# EAGLE schematic debugBoard (EAGLE 8.3.2)
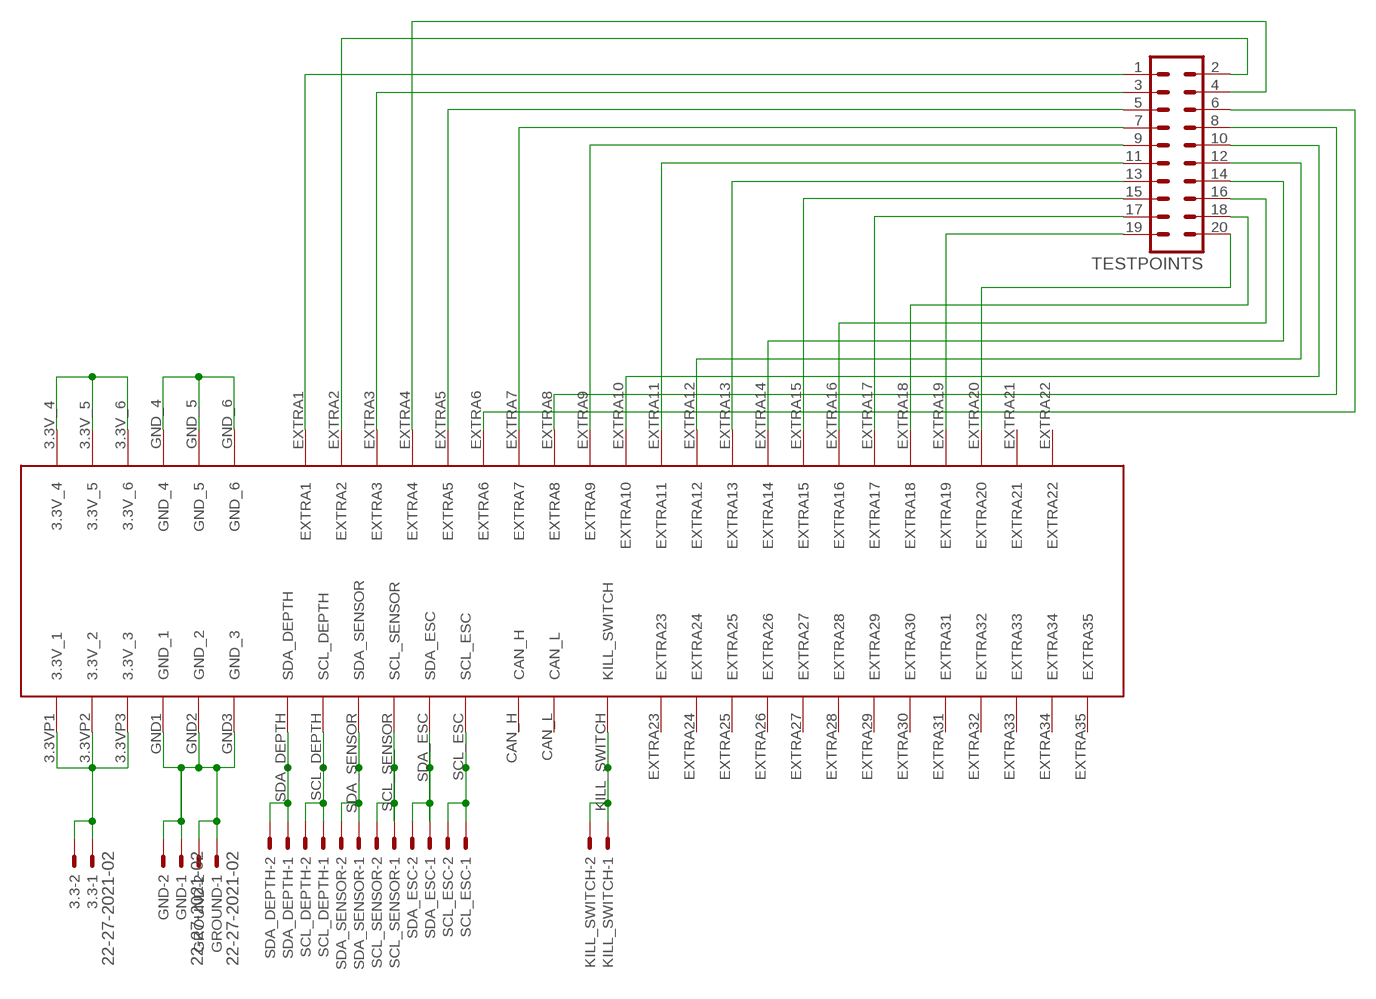
[diagram p0: schematic, sheet 1]

## Parts
3.3  22-27-2021-02  [6410-02]
GND  22-27-2021-02  [6410-02]
GROUND  22-27-2021-02  [6410-02]
KILL_SWITCH  22-27-2021-02  [6410-02]
SCL_DEPTH  22-27-2021-02  [6410-02]
SCL_ESC  22-27-2021-02  [6410-02]
SCL_SENSOR  22-27-2021-02  [6410-02]
SDA_DEPTH  22-27-2021-02  [6410-02]
SDA_ESC  22-27-2021-02  [6410-02]
SDA_SENSOR  22-27-2021-02  [6410-02]
TESTPOINTS  MA10-2  [MA10-2]
U$1  5530843  [5530843-6-BOARDFINGERS]

## Nets
3.3V: 3.3.1 3.3.2 U$1.3.3V_4 U$1.3.3V_5 U$1.3.3V_6 U$1.3.3VP1(3.3V_1) U$1.3.3VP2(3.3V_2) U$1.3.3VP3(3.3V_3)
EXTRA1: TESTPOINTS.1 U$1.EXTRA1
EXTRA2: TESTPOINTS.2 U$1.EXTRA2
EXTRA3: TESTPOINTS.3 U$1.EXTRA3
EXTRA4: TESTPOINTS.4 U$1.EXTRA4
EXTRA5: TESTPOINTS.5 U$1.EXTRA5
EXTRA6: TESTPOINTS.6 U$1.EXTRA6
EXTRA7: TESTPOINTS.7 U$1.EXTRA7
EXTRA8: TESTPOINTS.8 U$1.EXTRA8
EXTRA9: TESTPOINTS.9 U$1.EXTRA9
EXTRA10: TESTPOINTS.10 U$1.EXTRA10
EXTRA11: TESTPOINTS.11 U$1.EXTRA11
EXTRA12: TESTPOINTS.12 U$1.EXTRA12
EXTRA13: TESTPOINTS.13 U$1.EXTRA13
EXTRA14: TESTPOINTS.14 U$1.EXTRA14
EXTRA15: TESTPOINTS.15 U$1.EXTRA15
EXTRA16: TESTPOINTS.16 U$1.EXTRA16
EXTRA17: TESTPOINTS.17 U$1.EXTRA17
EXTRA18: TESTPOINTS.18 U$1.EXTRA18
EXTRA19: TESTPOINTS.19 U$1.EXTRA19
EXTRA20: TESTPOINTS.20 U$1.EXTRA20
GND: GND.1 GND.2 GROUND.1 GROUND.2 U$1.GND1(GND_1) U$1.GND2(GND_2) U$1.GND3(GND_3) U$1.GND_4 U$1.GND_5 U$1.GND_6
KILL_SWITCH: KILL_SWITCH.1 KILL_SWITCH.2 U$1.KILL_SWITCH
SCL_DEPTH: SCL_DEPTH.1 SCL_DEPTH.2 U$1.SCL_DEPTH
SCL_ESC: SCL_ESC.1 SCL_ESC.2 U$1.SCL_ESC
SCL_SENSOR: SCL_SENSOR.1 SCL_SENSOR.2 U$1.SCL_SENSOR
SDA_DEPTH: SDA_DEPTH.1 SDA_DEPTH.2 U$1.SDA_DEPTH
SDA_ESC: SDA_ESC.1 SDA_ESC.2 U$1.SDA_ESC
SDA_SENSOR: SDA_SENSOR.1 SDA_SENSOR.2 U$1.SDA_SENSOR
Unconnected: U$1.CAN_H U$1.CAN_L U$1.EXTRA21 U$1.EXTRA22 U$1.EXTRA23 U$1.EXTRA24 U$1.EXTRA25 U$1.EXTRA26 U$1.EXTRA27 U$1.EXTRA28 U$1.EXTRA29 U$1.EXTRA30 U$1.EXTRA31 U$1.EXTRA32 U$1.EXTRA33 U$1.EXTRA34 U$1.EXTRA35

## Library data of the parts
3.3 GND GROUND KILL_SWITCH SCL_DEPTH SCL_ESC SCL_SENSOR SDA_DEPTH SDA_ESC SDA_SENSOR = con-molex:22-?-02: CONNECTOR wire to board 2.54 mm (.1 inch) pitch header; OC_FARNELL: unknown; OC_NEWARK: unknown
TESTPOINTS = con-lstb:MA10-2: PIN HEADER; OC_FARNELL: unknown; OC_NEWARK: unknown
U$1 = 5530843-6:5530843